# EasyEDA Pro project ProPrj_智能警报器（终版）_2025-03-04_22-10-02_2025-04-22.epro, board 警报装置旧PCB
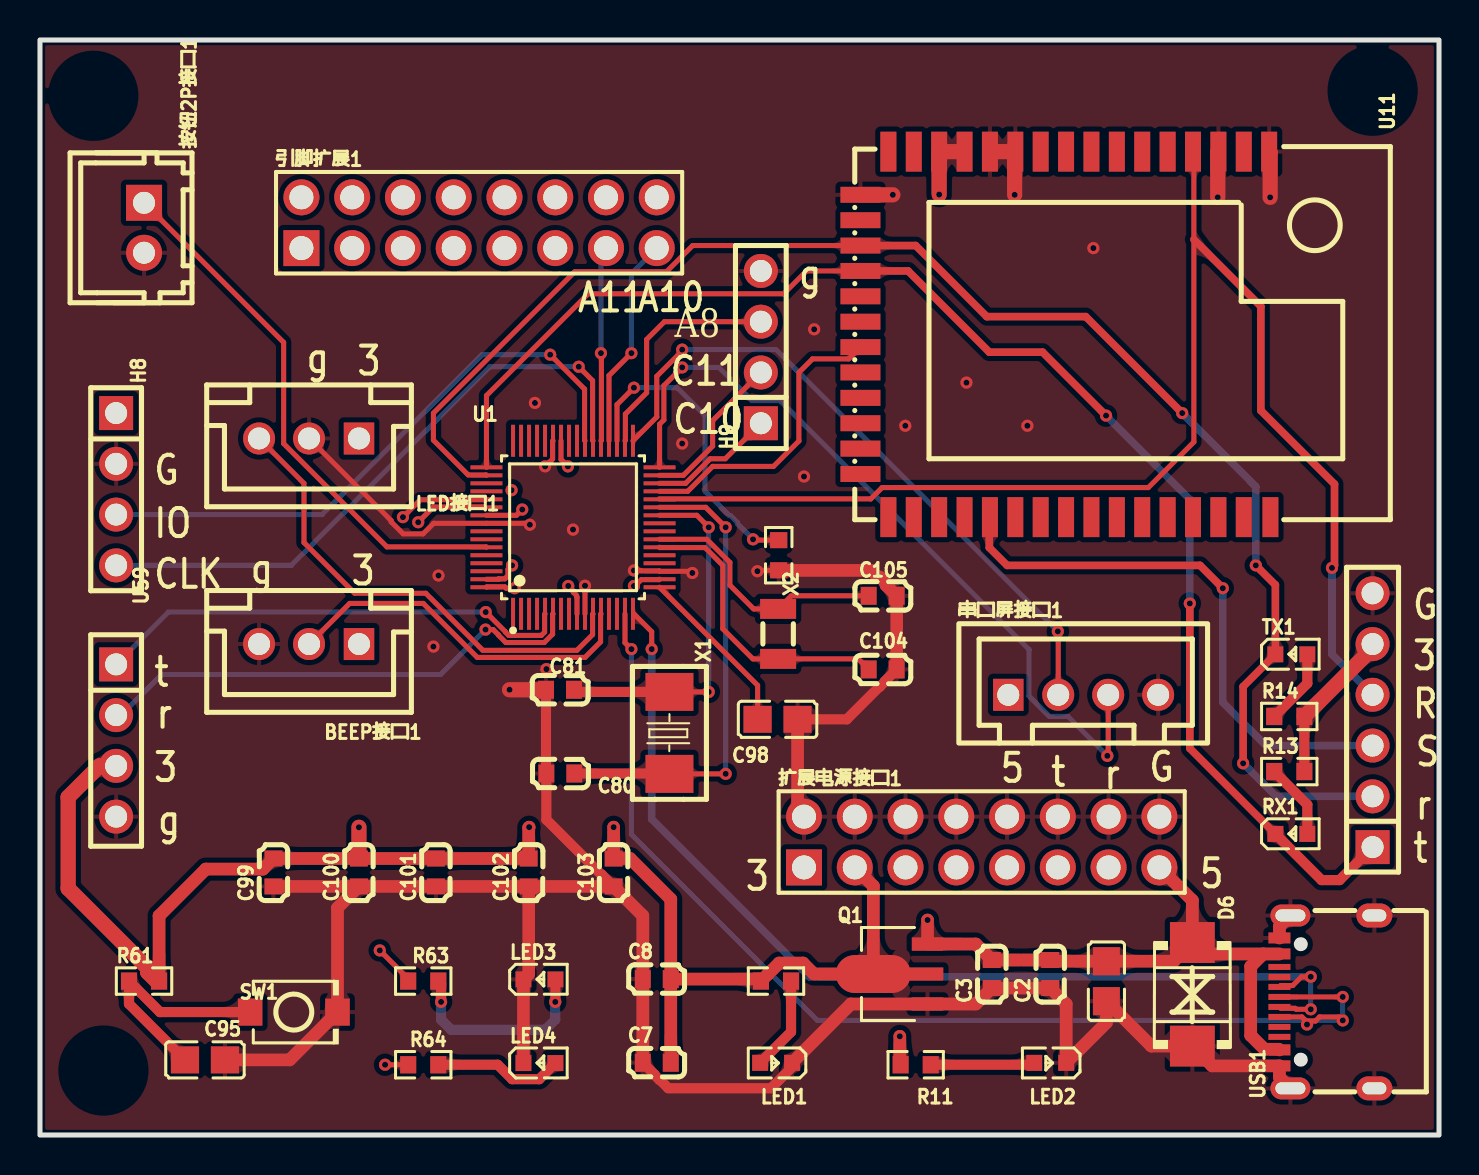
[diagram p12: board, top side]
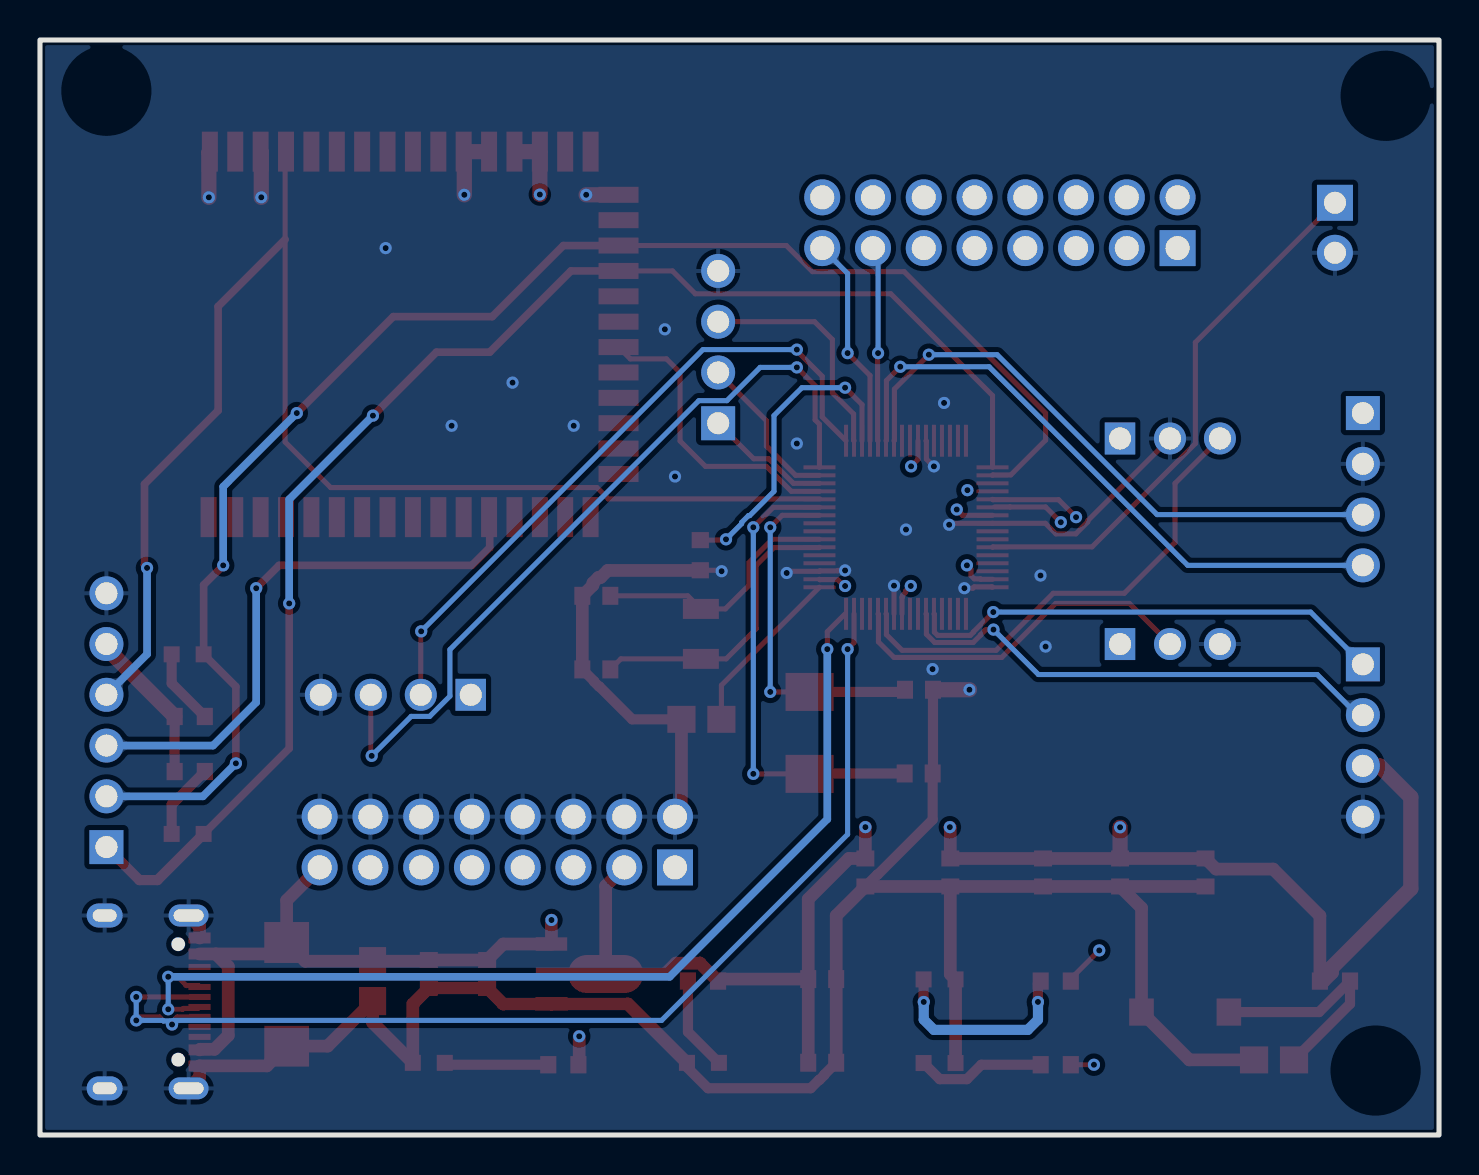
[diagram p13: board, bottom side, seen from below]

Outline 70 x 54.79 mm; copper layers: Top Layer, Inner1, Inner2, Bottom Layer. Coordinates in mm from the lower left corner of the outline.
Outline path: rectangle 0,54.79 70,0
Stack: Top Layer 0.035mm 外层铜厚1oz / Dielectric1 0.2104mm 7628 RC49% 8.6mil / Inner1 0.0152mm 内层铜厚 / Dielectric2 1.065mm 1.1mm H/HOZ Copper / Inner2 0.0152mm 内层铜厚 / Dielectric3 0.2104mm 7628 RC49% 8.6mil / Bottom Layer 0.035mm 外层铜厚1oz

## Design rules (mm)
template: JLCPCB Capability(Multiple Layers Board)
spacing copperThickness1oz (default): track to track 0.102, other pairs 0.152 to 0.3
spacing copperThickness2oz: track to track 0.203, other pairs 0.152 to 0.3
spacing copperThicknessInner0.5oz: track to track 0.089, other pairs 0.152 to 0.3
track width copperThickness1oz (default): min 0.102, default 0.254, max 2.54
track width copperThickness2oz: min 0.203, default 0.254, max 2.54
track width copperThickness0.5oz: min 0.089, default 0.254, max 2.54
differential pair differentialPair (default): width min 0.127, default 0.254, max 2.54; gap min 0.152, default 0.152
via viaSize (default): diameter min 0.3, default 0.61, max 10; hole min 0.2, default 0.305, max 6.3

## Placement (name value [footprint] x y rotation side)
BEEP接口1  ZX-XH2.54-3PZZ-R  [CONN-TH_3P-P2.50_ZX-XH2.54-3PZZ-R]  13.46 24.57 180 top
C2  10uF  [C0603]  50.55 8.06 90 top
C3  100nF  [C0603]  47.62 8.06 90 top
C7  10uF  [C0603]  30.86 3.62 0 top
C8  100nF  [C0603]  30.86 7.8 0 top
C77  10uF  [C0805]  53.36 7.7 90 top
C80  22pF  [C0603]  26.03 18.09 180 top
C81  22pF  [C0603]  26.02 22.28 180 top
C95  10uF  [C0805]  8.25 3.76 180 top
C98  2.2uF  [C0805]  36.91 20.8 0 top
C99  100nF  [C0603]  11.68 13.14 90 top
C100  100nF  [C0603]  15.96 13.14 90 top
C101  100nF  [C0603]  19.81 13.14 90 top
C102  100nF  [C0603]  24.45 13.14 90 top
C103  100nF  [C0603]  28.7 13.14 90 top
C104  18pF  [C0603]  42.16 23.3 180 top
C105  18pF  [C0603]  42.16 26.98 180 top
D6  SMBJ6.8CA  [SMB_L4.6-W3.6-LS5.3-BI]  57.66 7.04 270 top
H8  PZ254V-11-04P  [HDR-TH_4P-P2.54-V-M]  3.81 32.31 270 top
H9  PZ254V-11-04P  [HDR-TH_4P-P2.54-V-M]  36.07 39.43 90 top
LED1  KT-0603R  [LED0603-RD]  36.83 3.61 180 top
LED2  KT-0603R  [LED0603-RD]  50.55 3.61 180 top
LED3  KT-0603R  [LED0603-RD]  24.99 7.79 0 top
LED4  KT-0603R  [LED0603-RD]  24.99 3.6 0 top
LED接口1  ZX-XH2.54-3PZZ-R  [CONN-TH_3P-P2.50_ZX-XH2.54-3PZZ-R]  13.46 34.85 180 top
LORA调试接口1  PZ254-1-06-Z-2.5-G1  [HDR-TH_6P-P2.54-V-M]  66.67 20.76 90 top
Q1  AMS1117-3.3V  [SOT-89-3_L4.5-W2.5-P1.50-LS4.2-BR]  43.05 8.06 0 top
R11  1kΩ  [R0603]  43.81 3.52 180 top
R13  1kΩ  [R0603]  62.51 18.19 0 top
R14  1kΩ  [R0603]  62.51 20.94 0 top
R15  1kΩ  [R0603]  36.83 7.7 180 top
R61  10kΩ  [R0603]  5.21 7.7 0 top
R62  10kΩ  [R0603]  36.96 29.01 90 top
R63  1kΩ  [R0603]  19.18 7.7 180 top
R64  1kΩ  [R0603]  19.18 3.52 180 top
RX1  KT-0603R  [LED0603-RD]  62.61 15.07 0 top
SW1  TS-1088-AR02016  [SW-SMD_L3.9-W3.0-P4.45]  12.7 6.15 0 top
TX1  KT-0603R  [LED0603-RD]  62.61 24.05 0 top
U1  HT32F52352  [LQFP-64_L7.0-W7.0-P0.40-LS9.2-BL]  26.67 30.41 0 top
U11  WH-L101-L-C  [COMM-SMD_WH-L101-L-C]  51.31 40.06 270 top
U59  PM254-1-04-Z-8.5  [HDR-TH_4P-P2.54-V-F]  3.81 19.74 270 top
USB1  TYPE-C 16PIN 2MD(073)  [USB-C-SMD_TYPE-C-6PIN-2MD-073]  64.39 6.66 90 top
X1  8MHz  [CRYSTAL-SMD_L5.0-W3.2]  31.5 20.12 270 top
X2  32.768kHz  [FC-135R_L3.2-W1.5]  36.93 25.08 270 top
串口屏接口1  ZX-XH2.54-4PZZ  [CONN-TH_4P-P2.50_4PIN]  52.2 22.03 0 top
引脚扩展1  PZ254V-12-16P  [HDR-TH_16P-P2.54-V-M-R2-C8-S2.54]  21.97 45.65 0 top
扩展电源接口1  PZ254V-12-16P  [HDR-TH_16P-P2.54-V-M-R2-C8-S2.54]  47.12 14.66 0 top
按钮2P接口1  ZX-XH2.54-2PZZ  [CONN-TH_2P-P2.50_HX25003-2A]  5.21 45.4 270 top

## Footprints (pads in the part's own frame, mm; a bottom-side part is the same pattern mirrored in y, then rotated)
C0603
  rect 0.8x0.9 smd: 1(-0.7,0) 2(0.7,0)
C0805
  rect 1.41x1.35 smd: 1(-1,0) 2(1,0)
COMM-SMD_WH-L101-L-C
  rect 2x0.8 smd: 1(-9.144,10.192) 2(-9.144,8.922) 3(-9.144,7.652) 4(-9.144,6.382) 5(-9.144,5.112) 6(-9.144,3.842) 7(-9.144,2.572) 8(-9.144,1.302) 9(-9.144,0.032) 10(-9.144,-1.238) 11(-9.144,-2.509) 12(-9.144,-3.779) 13(-9.144,-5.048) 14(-9.144,-6.319) 15(-9.144,-7.588) 16(-9.144,-8.858) 29(9.144,-8.858) 30(9.144,-7.588) 31(9.144,-6.319) 32(9.144,-5.048) 33(9.144,-3.779) 34(9.144,-2.509) 35(9.144,-1.238) 36(9.144,0.032) 37(9.144,1.302) 38(9.144,2.572) 39(9.144,3.842) 40(9.144,5.112) 41(9.144,6.382) 42(9.144,7.652) 43(9.144,8.922) 44(9.144,10.255)
  rect 0.8x2 smd: 17(-6.985,-10.255) 18(-5.715,-10.255) 19(-4.445,-10.255) 20(-3.175,-10.255) 21(-1.905,-10.255) 22(-0.635,-10.255) 23(0.635,-10.255) 24(1.905,-10.255) 25(3.175,-10.255) 26(4.445,-10.255) 27(5.715,-10.255) 28(6.985,-10.255)
CONN-TH_2P-P2.50_HX25003-2A
  rect 1.8x1.8 hole 1.1: 1(-1.25,0)
  round 1.8 hole 1.1: 2(1.25,0)
CONN-TH_3P-P2.50_ZX-XH2.54-3PZZ-R
  rect 1.524x1.6 hole 1.1: 1(-2.5,0)
  round 1.6 hole 1.1: 2(0,0) 3(2.5,0)
CONN-TH_4P-P2.50_4PIN
  rect 1.524x1.6 hole 1.1: 1(-3.75,0)
  round 1.6 hole 1.1: 2(-1.25,0) 3(1.25,0) 4(3.75,0)
CRYSTAL-SMD_L5.0-W3.2
  rect 1.9x2.4 smd: 1(-2.05,0) 2(2.05,0)
FC-135R_L3.2-W1.5
  rect 1x1.8 smd: 1(-1.25,0) 2(1.25,0)
HDR-TH_4P-P2.54-V-F
  rect 1.7x1.7 hole 1.1: 1(-3.81,0)
  round 1.7 hole 1.1: 2(-1.27,0) 3(1.27,0) 4(3.81,0)
HDR-TH_4P-P2.54-V-M
  rect 1.7x1.7 hole 1.1: 1(-3.81,0)
  round 1.7 hole 1.1: 2(-1.27,0) 3(1.27,0) 4(3.81,0)
HDR-TH_6P-P2.54-V-M
  rect 1.7x1.7 hole 1.1: 1(-6.35,0)
  round 1.7 hole 1.1: 2(-3.81,0) 3(-1.27,0) 4(1.27,0) 5(3.81,0) 6(6.35,0)
HDR-TH_16P-P2.54-V-M-R2-C8-S2.54
  rect 1.8x1.8 hole 1.2: 1(-8.89,-1.27)
  round 1.8 hole 1.2: 2(-8.89,1.27) 3(-6.35,-1.27) 4(-6.35,1.27) 5(-3.81,-1.27) 6(-3.81,1.27) 7(-1.27,-1.27) 8(-1.27,1.27) 9(1.27,-1.27) 10(1.27,1.27) 11(3.81,-1.27) 12(3.81,1.27) 13(6.35,-1.27) 14(6.35,1.27) 15(8.89,-1.27) 16(8.89,1.27)
LED0603-RD
  rect 0.8x0.8 smd: 1(-0.799,0) 2(0.799,0)
LQFP-64_L7.0-W7.0-P0.40-LS9.2-BL
  rect 0.2x1.6 smd: 1(-3,-4.33) 2(-2.6,-4.33) 3(-2.2,-4.33) 4(-1.8,-4.33) 5(-1.4,-4.33) 6(-1,-4.33) 7(-0.6,-4.33) 8(-0.2,-4.33) 9(0.2,-4.33) 10(0.6,-4.33) 11(1,-4.33) 12(1.4,-4.33) 13(1.8,-4.33) 14(2.2,-4.33) 15(2.6,-4.33) 16(3,-4.33) 33(3,4.33) 34(2.6,4.33) 35(2.2,4.33) 36(1.8,4.33) 37(1.4,4.33) 38(1,4.33) 39(0.6,4.33) 40(0.2,4.33) 41(-0.2,4.33) 42(-0.6,4.33) 43(-1,4.33) 44(-1.4,4.33) 45(-1.8,4.33) 46(-2.2,4.33) 47(-2.6,4.33) 48(-3,4.33)
  rect 1.6x0.2 smd: 17(4.33,-3) 18(4.33,-2.6) 19(4.33,-2.2) 20(4.33,-1.8) 21(4.33,-1.4) 22(4.33,-1) 23(4.33,-0.6) 24(4.33,-0.2) 25(4.33,0.2) 26(4.33,0.6) 27(4.33,1) 28(4.33,1.4) 29(4.33,1.8) 30(4.33,2.2) 31(4.33,2.6) 32(4.33,3) 49(-4.33,3) 50(-4.33,2.6) 51(-4.33,2.2) 52(-4.33,1.8) 53(-4.33,1.4) 54(-4.33,1) 55(-4.33,0.6) 56(-4.33,0.2) 57(-4.33,-0.2) 58(-4.33,-0.6) 59(-4.33,-1) 60(-4.33,-1.4) 61(-4.33,-1.8) 62(-4.33,-2.2) 63(-4.33,-2.6) 64(-4.33,-3)
R0603
  rect 0.806x0.864 smd: 1(-0.753,0) 2(0.753,0)
SMB_L4.6-W3.6-LS5.3-BI
  rect 2.047x2.241 smd: 1(-2.591,0) 2(2.591,0)
SOT-89-3_L4.5-W2.5-P1.50-LS4.2-BR
  rect 1.575x0.672 smd: 1(1.356,-1.5) 3(1.356,1.5)
  custom 5.377x1.9 smd: 2(-1.356,0)
SW-SMD_L3.9-W3.0-P4.45
  rect 1.23x1.36 smd: 1(-2.185,0) 2(2.185,0)
USB-C-SMD_TYPE-C-6PIN-2MD-073
  rect 0.55x1.1 smd: 1(-3.2,2.375) 2(-2.4,2.375) 11(2.4,2.375) 12(3.2,2.375)
  rect 0.3x1.1 smd: 3(-1.75,2.375) 4(-1.25,2.375) 5(-0.75,2.375) 6(-0.25,2.375) 7(0.25,2.375) 8(0.75,2.375) 9(1.25,2.375) 10(1.75,2.375)
  oval 1.1x2 hole 0.6x1.5: 13(-4.325,1.825) 14(4.325,1.825)
  oval 1.2x1.8 hole 0.6x1.2: 13(-4.325,-2.375) 14(4.325,-2.375)

## Nets
As in the schematic.

Pads without a net: U11 2 5 6 7 8 9 10 15 16 18 21 22 24 25 26 27 28 29 30 31 32 34 35 36 37 38 39 40 41 42 43 44; USB1 3 4 9 10

## Via types
v1: diameter 0.61, hole 0.305, Top Layer to Bottom Layer, 72 vias

## Routing (per net, layer and track width the routed paths; a pad name or vN(x,y) marks a point on that pad's centre or on a via; arc(x,y) is an arc through that point)
3V3:
  vias: v1(23.6,32.27)
GND: length 366.1
  Top Layer w0.254: v1(23.75,27.36) 23.32,27.36 23.26,27.43 22.36,27.43 U1.64 ; v1(35.89,28.21) 35.94,28.26 R62.1 ; LED接口1.2 17.58,30.74 17.58,30.68 18.17,30.08 19.17,30.08 19.7,30.61 U1.56 24.44,30.61 v1(24.51,30.54) ; v1(29.72,28.25) 30.06,28.25 30.08,28.23 30.98,28.23 31,28.21 32.55,28.21 v1(32.64,28.12) ; U1.10 v1(27.27,27.49) ; v1(25.27,33.46) 25.48,33.66 25.49,33.66 25.65,33.82 25.65,34.72 U1.43
  Top Layer w0.508: C104.1 42.27,22.7 42.27,22.68 42.03,22.44 42.01,22.44 40.37,20.8 C98.2 ; C103.1 28.11,13.03 28.08,13.03 25.33,15.78 C80.2 25.32,18.11 C81.2 ; C7.1 30.75,3.02 30.75,3 30.99,2.76 31.02,2.76 31.44,2.34 36.58,2.34 37.63,3.4 LED1.1
  Top Layer w0.635: LED4.1 LED3.1 24.45,8.05 C102.1 ; C102.1 C103.1 30.16,10.98 C8.1 C7.1 ; C102.1 C101.1 C100.1 ; C98.2 37.91,16.25 扩展电源接口1.2 ; C100.1 14.88,11.36 SW1.2 12.49,3.76 9.4,3.76 ; C100.1 C99.1 ; LED1.1 40.57,6.56 Q1.1 46.83,6.56 C3.1 C2.1 51.35,6.56 LED2.1 53.36,5.62 C77.1 55.61,4.45 D6.2 58.65,3.46 USB1.1 62.01,2.89 USB1.13 ; C104.1 C105.1 42.33,27.51 42.33,27.62 42.06,27.9 41.94,27.9 41.59,28.25 37.08,28.25 ; USB1.14 62.01,10.44 USB1.12
  Top Layer w0.762: v1(61.55,46.92) 61.55,49.15 61.5,49.21 ; U11.3 58.93,49.17 v1(58.93,46.92) ; v1(48.77,47.05) 48.77,49.17 U11.11 47.53,49.21 ; v1(42.67,47.05) U11.17 ; v1(23.49,22.28) C81.2
  Inner1 w0.254: v1(26.67,30.29) 26.67,32.06 v1(25.27,33.46) ; v1(26.67,30.29) 27.27,29.69 ; v1(26.67,30.29) 23.75,27.37 v1(23.75,27.36) ; v1(26.67,30.29) 26.43,30.54 v1(24.51,30.54) ; v1(29.72,28.25) 28.71,28.25 27.27,29.69 ; 27.27,29.69 v1(27.27,27.49) 27.27,25.24 v1(25.34,23.31) ; v1(35.89,28.21) 32.73,28.21 v1(32.64,28.12)
  Inner1 w0.762: 串口屏接口1.4 61.03,27.11 LORA调试接口1.6 68.06,25.72 68.06,13.34 66.76,12.04 USB1.14 ; USB1.14 USB1.14 ; USB1.14 66.76,2.5 ; LED接口1.2 13.59,34.98 ; 13.59,34.98 18.67,40.06 30.1,40.06 33.27,43.24 H9.4 37.34,41.97 51.82,41.97 52.7,42.86 v1(52.7,44.38) ; 13.59,34.98 13.59,35.76 7.11,42.24 ; v1(52.7,44.38) 50.04,47.05 v1(48.77,47.05) ; v1(52.7,44.38) 45.34,44.38 v1(42.67,47.05) ; v1(52.7,44.38) 56.39,44.38 v1(58.93,46.92) v1(61.55,46.92) ; 7.11,42.24 7.11,36.89 H8.2 ; 7.11,42.24 按钮2P接口1.2 ; U59.4 10.96,23.08 BEEP接口1.3 13.25,22.28 v1(23.49,22.28) ; 扩展电源接口1.2 扩展电源接口1.4 扩展电源接口1.6 扩展电源接口1.8 扩展电源接口1.10 扩展电源接口1.12 扩展电源接口1.14 扩展电源接口1.16 ; 62.82,2.46 67.02,2.46
  vias: v1(19.68,24.44) v1(19.94,28) v1(24.77,36.63) v1(32.13,34.6) v1(38.23,32.95) v1(38.73,40.32) v1(43.3,35.49) v1(46.36,37.65) v1(49.4,35.49)
VCC+3.3V: length 238.1
  Top Layer w0.254: v1(26.42,33.46) 26.07,33.8 U1.42 ; v1(26.43,27.47) 26.69,27.22 26.69,27.16 26.85,26.99 26.85,26.93 26.87,26.91 U1.9 ; U1.55 23.84,31.01 v1(24.13,31.3) ; 31,27.81 30.98,27.79 30.08,27.79 29.77,27.47 v1(29.72,27.47) ; v1(23.62,28.5) 23.42,28.3 23.42,27.99 23.26,27.83 22.95,27.83 22.93,27.81 U1.63
  Top Layer w0.508: R13.2 R14.2
  Top Layer w0.635: v1(24.48,15.41) 24.45,15.38 C102.2 C101.2 C100.2 C99.2 11.15,13.31 8.3,13.31 5.96,10.97 R61.2 ; C8.2 31.56,11.8 29.53,13.84 C103.2 v1(28.7,15.41) ; C8.2 C7.2 ; C8.2 35.97,7.8 R15.2 36.43,8.06 36.43,8.06 36.98,8.6 38.18,8.6 38.72,8.06 Q1.2 41.7,12.46 扩展电源接口1.3
  Top Layer w0.762: U11.13 44.99,49.21 v1(44.99,47.06) ; LORA调试接口1.5 66.67,24.36 R14.2 ; v1(15.96,15.4) C100.2 ; U59.3 2.98,18.47 1.41,16.91 1.41,12.33 5.39,8.36 5.39,8.15 5.83,7.7 R61.2
  Inner2 w0.254: v1(23.62,28.5) 22.31,28.5 LED接口1.1 ; v1(23.62,28.5) 25.4,28.5 ; v1(23.62,28.5) 26.42,31.3 ; 26.42,31.3 v1(26.42,33.46) ; 26.42,31.3 v1(24.13,31.3) ; 25.4,28.5 27.08,28.5 28.11,27.47 v1(29.72,27.47) ; 25.4,28.5 v1(26.43,27.47)
  Inner2 w0.635: 扩展电源接口1.7 扩展电源接口1.5 扩展电源接口1.3 扩展电源接口1.1 ; BEEP接口1.1 LED接口1.1 ; v1(28.7,15.41) v1(24.48,15.41)
  Inner2 w0.762: v1(44.99,47.06) 43.71,45.78 34.28,45.78 31.45,42.95 27.14,42.95 24,39.81 20.92,39.81 LED接口1.1 ; H8.1 1.52,33.84 1.52,21.34 3.81,19.06 U59.3 ; v1(15.96,15.4) 15.96,15.4 BEEP接口1.1 ; LORA调试接口1.5 54.86,24.57 53.66,23.36 47.05,23.36 42.67,18.98 39.25,18.98 36.79,16.52 36.79,15.34 38.23,13.9 扩展电源接口1.1
VCC+5V: length 67.8
  Top Layer w0.635: D6.1 56.72,8.7 C77.2 50.61,8.7 C2.2 C3.2 46.83,9.56 Q1.3 v1(44.41,10.76) ; D6.1 58.23,9.06 61.2,9.06 ; D6.1 57.66,11.74 扩展电源接口1.15 ; R11.2 43.02,3.56 v1(43.02,4.94) ; USB1.11 61.2,9.06 ; 61.2,9.06 60.58,8.44 60.58,4.98 61.27,4.29 61.98,4.29 USB1.2
  Inner2 w0.635: v1(43.02,4.94) 44.41,6.33 v1(44.41,10.76) ; 扩展电源接口1.15 扩展电源接口1.13 ; 扩展电源接口1.11 扩展电源接口1.9 48.45,13.45 55.46,13.45 57.38,15.36 57.38,16.5 56.57,17.3 48.95,17.3 48.45,17.81 串口屏接口1.1
BOOT: length 15.7
  Top Layer w0.254: U1.35 28.87,36.55 v1(29.72,37.39) ; v1(35.68,29.81) 35.72,29.77 R62.2
  Bottom Layer w0.254: v1(29.72,37.39) 31.88,37.39 33.27,36 33.27,32.21 34.49,30.99 34.55,30.99 34.89,30.65 34.89,30.59 v1(35.68,29.81)
LCD_RX: length 33.4
  Top Layer w0.254: 串口屏接口1.2 50.95,25.18 v1(50.93,25.2) ; v1(32.13,39.3) 32.13,39.24 30.86,37.97 30.86,35.93 U1.33
  Bottom Layer w0.254: v1(32.13,39.3) 36.83,39.3 v1(50.93,25.2)
LCD_TX: length 39.2
  Top Layer w0.254: 串口屏接口1.3 53.45,19.02 v1(53.4,18.97) ; v1(32.13,38.41) 31.22,37.5 31.22,35.78 31,35.57 31,33.41
  Bottom Layer w0.254: v1(32.13,38.41) 33.97,38.41 35.63,36.75 37.03,36.75 49.49,24.29 49.49,21.96 50.5,20.95 51.43,20.95 v1(53.4,18.97)
LORA_RESET: length 68.5
  Top Layer w0.254: 57.69,48.68 57.73,48.64 57.73,34.68 55.45,32.4 42.14,32.4 41.57,31.83 30.99,31.83
  Top Layer w0.381: v1(64.64,28.38) 64.77,28.5 64.77,32.57 61.09,36.25 61.09,41.46 57.73,44.81
  Bottom Layer w0.381: LORA调试接口1.4 64.64,24.06 v1(64.64,28.38)
LORA_RX: length 76.4
  Top Layer w0.254: U1.50 22.32,33.03 21.42,33.03 19.68,34.77 19.68,36.12 26.76,43.2 31.35,43.2 32.66,44.51 U11.19
  Top Layer w0.381: v1(60.83,28.5) 61.81,27.53 TX1.1 60.2,22.44 v1(60.2,18.6) ; v1(57.15,36.12) 52.32,40.95 47.37,40.95 43.81,44.51 U11.19
  Bottom Layer w0.381: v1(60.2,18.6) 61.85,16.95 LORA调试接口1.2 ; v1(60.83,28.5) 60.83,32.44 v1(57.15,36.12)
LORA_SWIM: length 28.2
  Top Layer w0.381: v1(59.18,27.36) 58.04,28.5 48.39,28.5 47.5,29.39 47.5,30.89 47.53,30.92
  Bottom Layer w0.381: v1(59.18,27.36) 59.18,21.65 61.34,19.49 LORA调试接口1.3
LORA_TX: length 71.1
  Top Layer w0.254: U11.20 38.35,43.24 37.21,42.09 27.43,42.09 22.34,37 U1.49
  Top Layer w0.381: v1(53.34,36) 50.17,39.17 47.5,39.17 43.43,43.24 U11.20 ; RX1.1 57.53,19.35 v1(57.53,26.6)
  Top Layer w0.508: RX1.1 64.12,12.76 65.02,12.76 LORA调试接口1.1
  Bottom Layer w0.381: v1(57.53,26.6) 57.53,31.81 v1(53.34,36)
LORA_WAKE: length 15.1
  Top Layer w0.254: U11.23 40.46,38.84 38.65,38.84 37.97,38.16 37.97,34.73 36.7,33.46 33.65,33.46 32.41,32.21 31,32.21
PA4: length 24
  Top Layer w0.254: U1.5 25.25,26.06 25.25,25.16 25.09,25 23.45,25 23.29,25.16 23.29,25.18 v1(22.3,26.17)
  Bottom Layer w0.254: U59.1 6.43,26.17 v1(22.3,26.17)
PA5: length 25.1
  Top Layer w0.254: U1.6 25.65,26.06 25.65,25.06 25.23,24.64 23.31,24.64 22.93,25.02 22.93,25.03 22.68,25.29 v1(22.29,25.29)
  Bottom Layer w0.254: v1(22.29,25.29) 20.05,23.04 6.1,23.04 4.06,21.01 U59.2
PA8: length 11.6
  Top Layer w0.254: H9.3 31.24,40.7 30.35,39.81 30.35,37.14 29.29,36.08 29.29,34.76 U1.34
PA10: length 10.6
  Top Layer w0.254: v1(29.59,39.12) 28.47,38 U1.36
  Bottom Layer w0.254: 引脚扩展1.15 29.59,43.11 v1(29.59,39.12)
PA11: length 9.8
  Top Layer w0.254: v1(28.07,39.12) 28.09,39.1 28.09,34.76 U1.37
  Bottom Layer w0.254: 引脚扩展1.13 28.07,44.13 v1(28.07,39.12)
PC4: length 24.2
  Top Layer w0.254: U1.11 27.65,26.06 27.65,25.04 26.86,24.25 22.16,24.25 19.3,27.11 15.75,27.11 13.21,29.65 13.21,32.61 LED接口1.3
PC5: length 18.3
  Top Layer w0.254: BEEP接口1.2 15.49,26.6 19.18,26.6 21.88,23.9 27.27,23.9 28.05,24.68 28.05,26.06 U1.12
PC10: length 6.3
  Top Layer w0.254: 31,32.61 32.3,32.61 33.53,33.84 34.29,33.84 H9.1
PC11: length 7.9
  Top Layer w0.254: 31,33.01 32.19,33.01 33.65,34.47 33.65,35.74 H9.2
PC14: length 28.8
  Top Layer w0.254: v1(17,9.24) 18.42,7.82 R63.2 ; v1(18.16,30.92) 19.03,31.79 22.32,31.79 U1.53
  Inner2 w0.254: v1(18.16,30.92) 17,29.76 17,9.24
PC15: length 32.6
  Top Layer w0.254: 22.23,31.43 21.47,31.43 21.46,31.43 19.68,31.43 v1(18.92,30.66) ; R64.2 v1(17.27,3.52)
  Inner2 w0.254: v1(17.27,3.52) 17.27,8.68 17.59,9 17.59,29.33 v1(18.92,30.66)
STOP_KEY: length 27.2
  Top Layer w0.254: U1.59 22.32,29.43 17.36,29.43 12.19,34.6 12.19,39.66 按钮2P接口1.1
SWCLK: length 31.3
  Top Layer w0.254: U1.38 27.65,34.76 27.65,37.75 v1(26.96,38.44)
  Bottom Layer w0.254: v1(26.96,38.44) 22.51,38.44 12.57,28.5 H8.4
SWDIO: length 30.1
  Top Layer w0.254: v1(25.53,39.05) 27.25,37.32 27.25,34.76 U1.39
  Bottom Layer w0.254: v1(25.53,39.05) 22.11,39.05 14.11,31.04 H8.3
USBDM: length 58.4
  Top Layer w0.254: USB1.7 v1(65.18,6.91) ; USB1.5 63.14,5.91 63.34,5.71 63.82,5.71 64.03,5.91 65.01,5.91 v1(65.18,5.74) ; U1.15 29.27,24.63 v1(29.59,24.31)
  Bottom Layer w0.254: v1(29.59,24.31) 29.59,15.04 38.9,5.74 63.31,5.74 63.34,5.71 63.82,5.71 63.85,5.74 v1(65.18,5.74) v1(65.18,6.91)
  vias: v1(63.39,5.53)
USBDP: length 51.9
  Top Layer w0.254: 29.71,26.08 30.61,25.18 v1(30.61,24.31) ; v1(63.58,6.29) 62.85,6.29 62.8,6.34 62.08,6.34 USB1.6 ; v1(63.58,7.92) 63.12,7.92 62.68,7.48 62.08,7.48 USB1.8
  Bottom Layer w0.254: v1(63.58,7.92) v1(63.58,6.29)
  Bottom Layer w0.381: v1(63.58,7.92) 38.49,7.92 30.61,15.8 v1(30.61,24.31)
X32KIN: length 14.9
  Top Layer w0.254: 31,29.41 31.02,29.39 33.27,29.39 34.16,28.5 34.16,25.33 35.67,23.83 40.94,23.83 41.46,23.3
X32KOUT: length 12.8
  Top Layer w0.254: 41.46,26.98 37.59,26.98 36.93,26.33 35.71,26.33 34.52,27.51 34.52,28.65 33.36,29.81 31,29.81
XTALIN: length 17.7
  Top Layer w0.254: 31,31.01 32.86,31.01 v1(33.46,30.41) ; X1.1 v1(33.46,22.17)
  Top Layer w0.508: C81.1 26.83,22.17 X1.1
  Bottom Layer w0.254: v1(33.46,22.17) v1(33.46,30.41)
XTAOUT: length 23.6
  Top Layer w0.254: X1.2 v1(34.31,18.07) ; 31,31.41 33.31,31.41 v1(34.31,30.41)
  Top Layer w0.508: X1.2 31.48,18.09 C80.1
  Bottom Layer w0.254: v1(34.31,18.07) v1(34.31,30.41)
$1N1719: length 8.6
  Top Layer w0.254: 31,27.41 35.91,22.5 C98.1
$1N3071: length 11.8
  Top Layer w0.508: C95.2 4.45,6.56 R61.1 6,6.15 SW1.1
$1N5057: length 10.1
  Top Layer w0.508: v1(25.78,6.66) 25.79,6.67 LED3.2 ; v1(20.07,6.66) 20.07,7.56 R63.1
  Bottom Layer w0.508: v1(20.07,6.66) 20.07,6.66 20.07,5.77 20.57,5.26 25.27,5.26 25.78,5.77 v1(25.78,6.66)
$1N5060: length 6.5
  Top Layer w0.508: R64.1 22.9,3.52 23.62,2.8 24.98,2.8 LED4.2
$2N1998: length 3.8
  Top Layer w0.508: TX1.2 63.41,22.6 R14.1
$2N1999: length 3.8
  Top Layer w0.508: R13.1 63.41,16.53 RX1.2
$3N700: length 5.2
  Top Layer w0.508: LED2.2 49.65,3.52 R11.1
$3N701: length 4.7
  Top Layer w0.508: LED1.2 37.58,5.16 R15.1

## Copper pours and planes (outline as drawn; the poured copper is in the pictures)
GND on Top Layer: -0.76,57.59 73.41,57.59 73.41,-6.55 -0.76,-6.55
GND on Bottom Layer: -2.03,57.46 71.12,57.46 71.12,-1.59 -2.03,-1.59

Small or netless copper shapes (teardrops, artwork), in the pictures only: 199 on Top Layer, 45 on Bottom Layer, 47 on Inner1, 37 on Inner2

## Text on the board
Top Silkscreen Layer: 3 | G | IO | CLK | t | r | g | A11 | A10 | C11 | C10 | 5 | R | S | A8
